# EAGLE design BaseStation R1.1 (EAGLE 7.5.0)
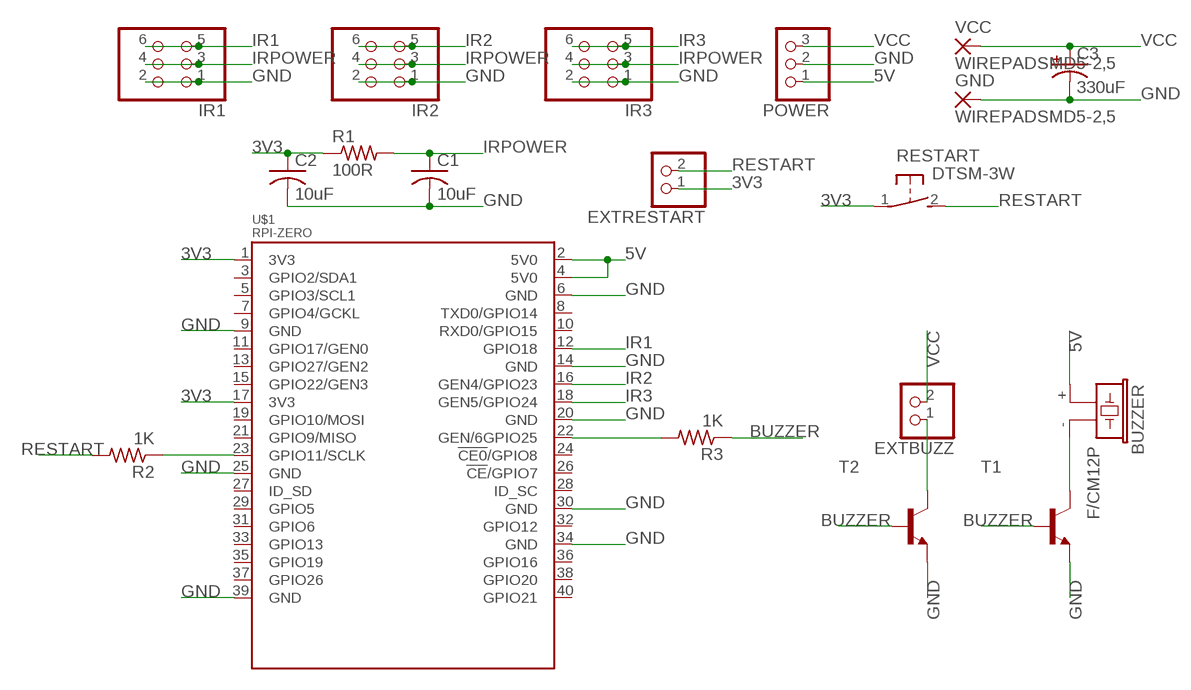
[diagram p0: schematic, sheet 1]

## Parts
BUZZER  F/CM12P  [F/CM12P]
C1  10uF  C-USC1206K  [C1206K]
C2  10uF  C-USC1206K  [C1206K]
C3  330uF  CPOL-USE3.5-8  [E3,5-8]
EXTBUZZ  PINHD-1X2  [1X02]
EXTRESTART  PINHD-1X2  [1X02]
GND  WIREPADSMD5-2,5  [5-2,5]
IR1  PINHD-2X3  [2X03]
IR2  PINHD-2X3  [2X03]
IR3  PINHD-2X3  [2X03]
POWER  PINHD-1X3  [1X03]
R1  100R  R-US_R1206W  [R1206W]
R2  1K  R-US_R1206W  [R1206W]
R3  1K  R-US_R1206W  [R1206W]
RESTART  DTSM-3W  [DTSM-3W]
T1  MMBT2222ALT1-NPN-SOT23-BEC  [SOT23-BEC]
T2  MMBT2222ALT1-NPN-SOT23-BEC  [SOT23-BEC]
U$1  RPI-ZERO  [RASPBERRYPI_BASTELSTUBE_V13_RASPI_BOARD_B+_FULL]
VCC  WIREPADSMD5-2,5  [5-2,5]

## Nets
3V3: C2.1 EXTRESTART.1 R1.1 RESTART.1 U$1.1(3V3) U$1.17(3V3)
5V: BUZZER.+ POWER.1 U$1.2(5V0) U$1.4(5V0)
BUZZER: R3.1 T1.B T2.B
GND: C1.2 C2.2 C3.- GND.1(P) IR1.1 IR1.2 IR2.1 IR2.2 IR3.1 IR3.2 POWER.2 T1.E T2.E U$1.6(GND) U$1.9(GND) U$1.14(GND) U$1.20(GND) U$1.25(GND) U$1.30(GND) U$1.34(GND) U$1.39(GND)
IR1: IR1.5 IR1.6 U$1.12(GPIO18)
IR2: IR2.5 IR2.6 U$1.16(GEN4/GPIO23)
IR3: IR3.5 IR3.6 U$1.18(GEN5/GPIO24)
IRPOWER: C1.1 IR1.3 IR1.4 IR2.3 IR2.4 IR3.3 IR3.4 R1.2
N$1: R2.1 U$1.23(GPIO11/SCLK)
N$2: R3.2 U$1.22(GEN/6GPIO25)
N$3: BUZZER.- T1.C
N$4: EXTBUZZ.1 T2.C
RESTART: EXTRESTART.2 R2.2 RESTART.2
VCC: C3.+ EXTBUZZ.2 POWER.3 VCC.1(P)
Unconnected: U$1.3(GPIO2/SDA1) U$1.5(GPIO3/SCL1) U$1.7(GPIO4/GCKL) U$1.8(TXD0/GPIO14) U$1.10(RXD0/GPIO15) U$1.11(GPIO17/GEN0) U$1.13(GPIO27/GEN2) U$1.15(GPIO22/GEN3) U$1.19(GPIO10/MOSI) U$1.21(GPIO9/MISO) U$1.24(!CE0!/GPIO8) U$1.26(!CE!/GPIO7) U$1.27(ID_SD) U$1.28(ID_SC) U$1.29(GPIO5) U$1.31(GPIO6) U$1.32(GPIO12) U$1.33(GPIO13) U$1.35(GPIO19) U$1.36(GPIO16) U$1.37(GPIO26) U$1.38(GPIO20) U$1.40(GPIO21)

## Library data of the parts
BUZZER = buzzer:F/CM12P: BUZZER Source: Buerklin; OC_FARNELL: unknown; OC_NEWARK: unknown
C1 C2 = rcl:C-US: CAPACITOR, American symbol
C3 = rcl:CPOL-US: POLARIZED CAPACITOR, American symbol
EXTBUZZ EXTRESTART = pinhead:PINHD-1X2: PIN HEADER
GND VCC = wirepad:WIREPAD: Wire PAD connect wire on PCB
IR1-IR3 = pinhead:PINHD-2X3: PIN HEADER
POWER = pinhead:PINHD-1X3: PIN HEADER
R1-R3 = rcl:R-US_: RESISTOR, American symbol
RESTART = switch-tact:DTSM-3W
T1 T2 = transistor-neu-to92:*-NPN-: NPN Transistror
U$1 = RPI-Zero:RPI-ZERO

## Board
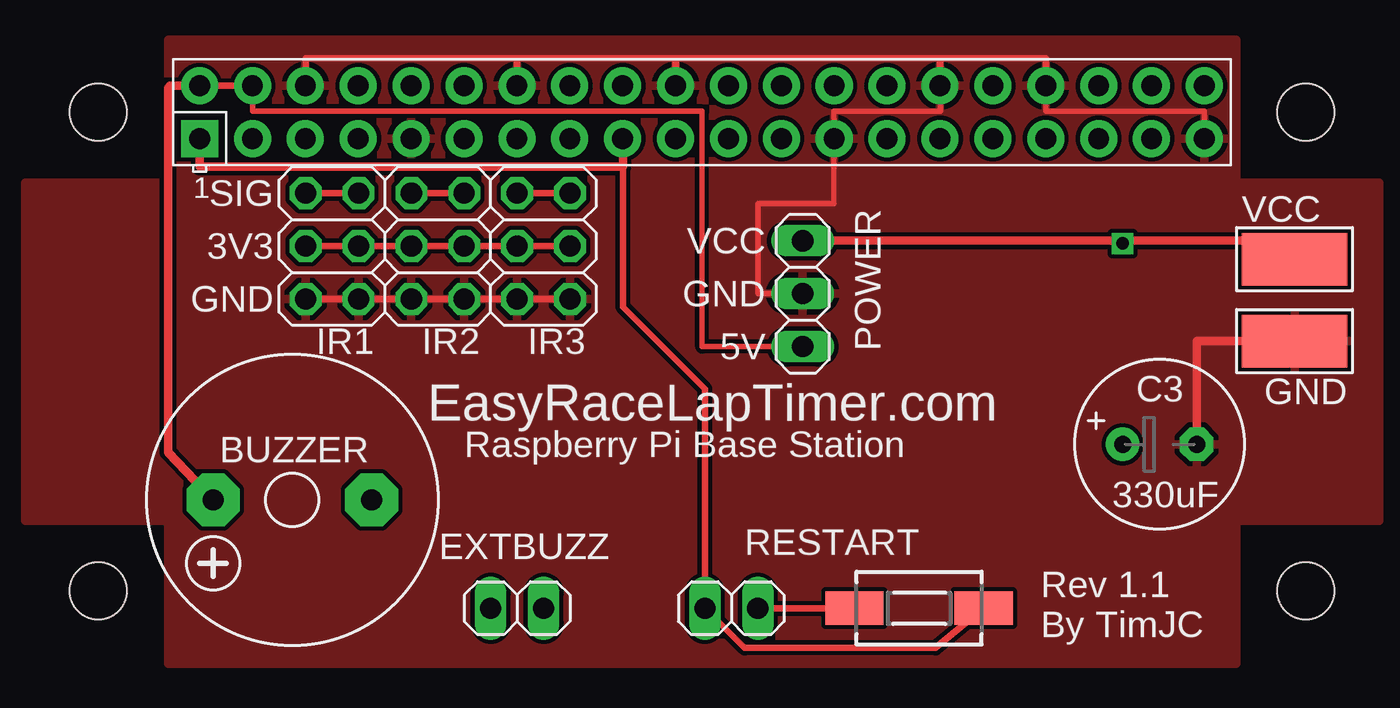
[diagram p1: board, top side]
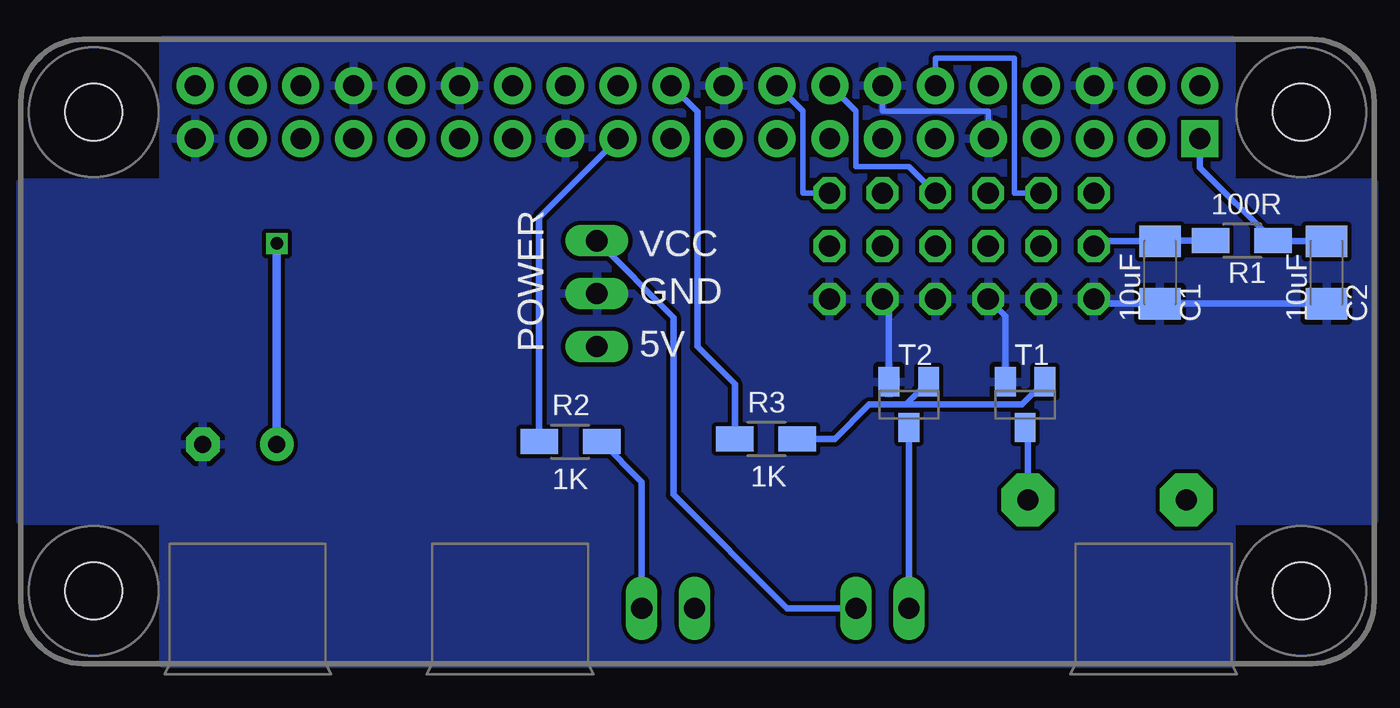
[diagram p2: board, bottom side, seen from below]

No outline drawn. Coordinates in mm, seen from the top.
Copper layers (1*16): Top 0.035mm / dielectric 1.5mm / Bottom 0.035mm
Design rules "default *": minimum track width 10mil, minimum drill 24mil, track to track 8mil, track to pad 8mil, pad to pad 8mil, via to via 8mil, smd to smd 8mil, copper to edge 40mil, drill to drill 8mil, minimum pad ring 10mil, minimum via ring 8mil, stop-mask expansion 4mil, vias tented up to drill 30mil, thermal gap 10mil

### Footprints (pad centres in the part's own frame; a part is rotated, then mirrored left to right if it is on the bottom)
F/CM12P = drill 1.016 pad 2.54 octagon: + 3.81,0; - -3.81,0
C1206K = smd 1.5 x 2: 1 -1.5,0; 2 1.5,0
E3,5-8 = drill 0.813 pad 1.6: + -1.778,0 | drill 0.813 pad 1.6 octagon: - 1.778,0
1X02 = drill 1.016 long: 1 -1.27,0; 2 1.27,0
5-2,5 = smd 2.54 x 5.08: 1 0,0
2X03 = drill 1.016 octagon: 1 -2.54,-1.27; 2 -2.54,1.27; 3 0,-1.27; 4 0,1.27; 5 2.54,-1.27; 6 2.54,1.27
1X03 = drill 1.016 long: 1 -2.54,0; 2 0,0; 3 2.54,0
R1206W = smd 1.8 x 1.2: 1 -1.499,0; 2 1.499,0
DTSM-3W = smd 2.8 x 1.6: 1 -3.1,0; 2 3.1,0
SOT23-BEC = smd 1 x 1.4: B -0.95,-1.1; C 0,1.1; E 0.95,-1.1
RASPBERRYPI_BASTELSTUBE_V13_RASPI_BOARD_B+_FULL = drill 1 pad 1.778 square: 1 8.37,25.23 | drill 1 pad 1.778: 2 8.37,27.77; 3 10.91,25.23; 4 10.91,27.77; 5 13.45,25.23; 6 13.45,27.77; 7 15.99,25.23; 8 15.99,27.77; 9 18.53,25.23; 10 18.53,27.77; 11 21.07,25.23; 12 21.07,27.77; 13 23.61,25.23; 14 23.61,27.77; 15 26.15,25.23; 16 26.15,27.77; 17 28.69,25.23; 18 28.69,27.77; 19 31.23,25.23; 20 31.23,27.77; 21 33.77,25.23; 22 33.77,27.77; 23 36.31,25.23; 24 36.31,27.77; 25 38.85,25.23; 26 38.85,27.77; 27 41.39,25.23; 28 41.39,27.77; 29 43.93,25.23; 30 43.93,27.77; 31 46.47,25.23; 32 46.47,27.77; 33 49.01,25.23; 34 49.01,27.77; 35 51.55,25.23; 36 51.55,27.77; 37 54.09,25.23; 38 54.09,27.77; 39 56.63,25.23; 40 56.63,27.77 | hole 2.75: 3.5,3.5; 3.5,26.5; 61.5,3.5; 61.5,26.5

### Placement (x,y rotation side)
BUZZER  12.83,7.87 180 top
C1  10.29,18.8 270 bottom
C2  2.29,18.8 270 bottom
C3  54.48,10.54 0 top
EXTBUZZ  23.62,2.67 0 top
EXTRESTART  33.91,2.67 0 top
GND  60.96,15.49 90 top
IR1  14.73,20.07 90 top
IR2  19.81,20.07 90 top
IR3  24.89,20.07 90 top
POWER  37.34,17.78 90 top
R1  6.35,20.32 180 bottom
R2  38.61,10.67 0 bottom
R3  29.21,10.79 180 bottom
RESTART  42.93,2.67 180 top
T1  16.76,12.45 180 bottom
T2  22.35,12.45 180 bottom
U$1  0,0 0 top
VCC  60.96,19.43 270 top

### Tracks (layer width: path | path; a pad name or v marks a point on that pad's centre or on a via)
3V3
  Top 0.305: U$1.17 28.7,25.22 28.7,17.14 32.64,13.21 EXTRESTART.1 34.54,0.76 43.72,0.76 RESTART.1
  Top 0.406: U$1.1 8.37,23.88 28.7,23.88 28.7,25.23 U$1.17
  Bottom 0.305: C2.1 4.83,20.3 R1.1 8.37,23.84 U$1.1
5V
  Top 0.254: U$1.4 10.91,26.54 32.51,26.54 32.51,15.24 POWER.1
  Top 0.305: U$1.2 U$1.4
  Top 0.406: BUZZER.+ 6.86,10.16 6.86,27.69 6.94,27.77 U$1.2
BUZZER
  Bottom 0.305: R3.1 25.91,10.79 24.26,12.45 22.86,12.45 22.5,12.45 | 22.5,12.45 T2.B | T1.B 16.91,12.45 22.5,12.45
GND
  Top 0.254: U$1.39 56.63,26.54 49.02,26.54 49.02,27.77 U$1.34 | 43.94,27.77 43.94,26.54 38.85,26.54 U$1.25 38.85,22.1 35.18,22.1 35.18,17.78 POWER.2
  Top 0.305: U$1.34 49.01,29.08 43.94,29.08 43.94,27.77 U$1.30 43.93,29.08 31.24,29.08 31.24,27.77 U$1.20 31.23,29.08 23.62,29.08 23.62,27.77 U$1.14 23.61,29.08 13.46,29.08 13.46,27.77 U$1.6 | IR1.2 IR1.1 IR2.2 IR2.1 IR3.2 IR3.1
  Top 0.406: C3.- 56.26,15.49 GND.1
  Bottom 0.254: U$1.9 18.53,26.54 23.62,26.54 23.62,27.77 U$1.14
  Bottom 0.305: T2.E 23.3,17.21 IR3.2 | T1.E 17.71,16.7 IR2.2 | C2.2 C1.2 13.23,17.3 IR1.2
  pour Top: 6.86,0 6.86,6.86 0,6.86 0,23.11 6.86,23.11 6.86,29.97 58.17,29.97 58.17,23.37 58.17,23.11 65.02,23.11 65.02,6.86 58.42,6.86 58.17,6.86 58.17,0
  pour Bottom: 0,6.86 0,23.11 6.86,23.11 6.86,29.97 58.17,29.97 58.17,23.11 65.02,23.11 65.02,6.86 58.17,6.86 58.17,0 6.86,0 6.86,6.86
IR1
  Top 0.305: IR1.6 IR1.5
  Bottom 0.254: IR1.5 17.27,22.61 17.27,29.08 21.07,29.08 U$1.12
IR2
  Top 0.305: IR2.6 IR2.5
  Bottom 0.254: IR2.5 22.35,23.88 24.89,23.88 24.89,26.54 26.12,27.77 U$1.16
IR3
  Top 0.305: IR3.6 IR3.5
  Bottom 0.254: IR3.5 27.43,22.61 27.43,26.54 28.66,27.77 U$1.18
IRPOWER
  Top 0.305: IR3.3 IR3.4 IR2.3 IR2.4 IR1.3 IR1.4
  Bottom 0.305: R1.2 10.26,20.32 C1.1 13.23,20.3 IR1.4
N$1
  Bottom 0.305: U$1.23 40.11,21.43 R2.1
N$2
  Bottom 0.305: U$1.22 32.51,26.51 32.51,15.24 30.71,13.44 R3.2
N$3
  Bottom 0.305: T1.C 16.64,11.22 BUZZER.-
N$4
  Bottom 0.305: T2.C EXTBUZZ.1
RESTART
  Top 0.305: EXTRESTART.2 RESTART.2
  Bottom 0.305: R2.2 35.18,8.74 EXTRESTART.2
VCC  (via drill 0.61)
  Top 0.406: POWER.3 52.7,20.32 | 52.7,20.32 60.07,20.32 arc-90 VCC.1 | v52.7,20.19 52.7,20.32
  Bottom 0.305: POWER.3 33.66,16.64 33.66,8.13 28.19,2.67 EXTBUZZ.2
  Bottom 0.406: C3.+ v52.7,20.19

### Text on the board
tNames: SIG | 3V3 | VCC | GND | GND | 5V | EasyRaceLapTimer.com | Raspberry Pi Base Station | Rev 1.1 / By TimJC
bNames: VCC | GND | 5V | POWER